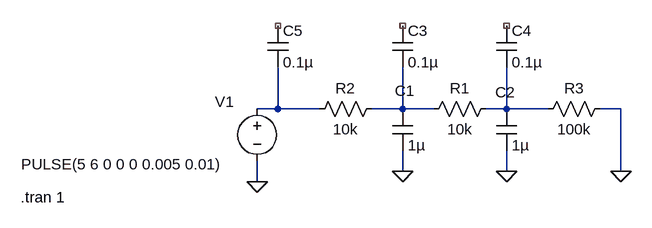
[diagram p0: schematic DampRC.asc]
DampRC.asc, the LTspice schematic file:
Version 4
SHEET 1 880 680
WIRE -48 192 -48 128
WIRE -48 192 -80 192
WIRE 16 192 -48 192
WIRE 144 192 144 128
WIRE 144 192 96 192
WIRE 192 192 144 192
WIRE 304 192 304 128
WIRE 304 192 272 192
WIRE 368 192 304 192
WIRE 480 192 448 192
WIRE 144 288 144 256
WIRE 304 288 304 256
WIRE 480 288 480 192
WIRE -80 304 -80 272
FLAG 144 288 0
FLAG 304 288 0
FLAG 480 288 0
FLAG -80 304 0
SYMBOL cap 128 192 R0
WINDOW 0 4 -28 Left 2
SYMATTR InstName C1
SYMATTR Value 1µ
SYMBOL cap 288 192 R0
WINDOW 0 -1 -26 Left 2
SYMATTR InstName C2
SYMATTR Value 1µ
SYMBOL res 288 176 R90
WINDOW 0 0 56 VBottom 2
WINDOW 3 32 56 VTop 2
SYMATTR InstName R1
SYMATTR Value 10k
SYMBOL res 112 176 R90
WINDOW 0 0 56 VBottom 2
WINDOW 3 32 56 VTop 2
SYMATTR InstName R2
SYMATTR Value 10k
SYMBOL res 464 176 R90
WINDOW 0 0 56 VBottom 2
WINDOW 3 32 56 VTop 2
SYMATTR InstName R3
SYMATTR Value 100k
SYMBOL voltage -80 176 R0
WINDOW 0 -65 5 Left 2
WINDOW 3 -363 101 Left 2
WINDOW 123 0 0 Left 0
WINDOW 39 0 0 Left 0
SYMATTR InstName V1
SYMATTR Value PULSE(5 6 0 0 0 0.005 0.01)
SYMBOL cap 128 64 R0
SYMATTR InstName C3
SYMATTR Value 0.1µ
SYMBOL cap 288 64 R0
SYMATTR InstName C4
SYMATTR Value 0.1µ
SYMBOL cap -64 64 R0
SYMATTR InstName C5
SYMATTR Value 0.1µ
TEXT -444 328 Left 2 !.tran 1

The netlist it stands for:
* DampRC.asc
C1 N002 0 1µ
C2 N003 0 1µ
R1 N003 N002 10k
R2 N002 N001 10k
R3 0 N003 100k
V1 N001 0 PULSE(5 6 0 0 0 0.005 0.01)
C3 NC_01 N002 0.1µ
C4 NC_02 N003 0.1µ
C5 NC_03 N001 0.1µ
.tran 1
.backanno
.end